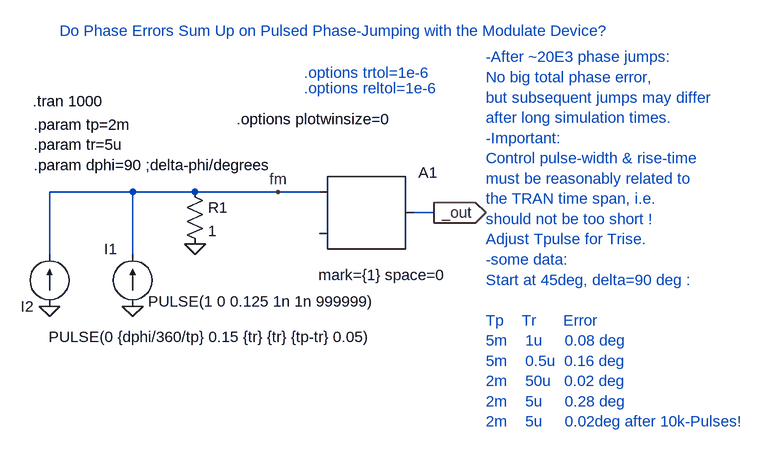
[diagram p0: schematic Ctrl_phase_Modulate_Phase_Error.asc]
Ctrl_phase_Modulate_Phase_Error.asc, the LTspice schematic file:
Version 4
SHEET 1 1348 932
WIRE -336 528 -464 528
WIRE -240 528 -336 528
WIRE -112 528 -240 528
WIRE -48 528 -112 528
WIRE 128 560 96 560
WIRE -464 624 -464 528
WIRE -336 624 -336 528
FLAG 128 560 _out
IOPIN 128 560 Out
FLAG -112 528 fm
FLAG -336 704 0
FLAG -240 608 0
FLAG -464 704 0
SYMBOL modulate -48 528 R0
WINDOW 3 -2 128 Left 0
WINDOW 123 16 -20 Left 0
SYMATTR Value mark={1} space=0
SYMATTR InstName A1
SYMBOL current -336 704 R180
WINDOW 0 24 88 Left 0
WINDOW 3 -375 7 Left 0
SYMATTR InstName I1
SYMATTR Value PULSE(1 0 0.125 1n 1n 999999)
SYMBOL res -256 512 R0
SYMATTR InstName R1
SYMATTR Value 1
SYMBOL current -464 704 R180
WINDOW 3 -501 -47 Left 0
WINDOW 123 0 0 Left 0
WINDOW 39 0 0 Left 0
SYMATTR Value PULSE(0 {dphi/360/tp} 0.15 {tr} {tr} {tp-tr} 0.05)
SYMATTR InstName I2
TEXT -490 388 Left 0 !.tran 1000
TEXT -176 416 Left 0 !.options plotwinsize=0
TEXT -488 424 Left 0 !.param tp=2m\n.param tr=5u\n.param dphi=90 ;delta-phi/degrees
TEXT -72 344 Left 0 ;.options trtol=1e-6
TEXT -72 368 Left 0 ;.options reltol=1e-6
TEXT -448 280 Left 0 ;Do Phase Errors Sum Up on Pulsed Phase-Jumping with the Modulate Device?
TEXT 208 320 Left 0 ;-After ~20E3 phase jumps:\nNo big total phase error,\nbut subsequent jumps may differ\nafter long simulation times.\n-Important:\nControl pulse-width & rise-time\nmust be reasonably related to\nthe TRAN time span, i.e.\nshould not be too short !\nAdjust Tpulse for Trise.\n-some data:\nStart at 45deg, delta=90 deg :\n \nTp    Tr      Error\n5m    1u     0.08 deg\n5m    0.5u  0.16 deg\n2m    50u   0.02 deg\n2m    5u     0.28 deg\n2m    5u     0.02deg after 10k-Pulses!

The netlist it stands for:
* Ctrl_phase_Modulate_Phase_Error.asc
A1 fm 0 0 0 0 0 _out 0 MODULATOR mark={1} space=0
I1 0 fm PULSE(1 0 0.125 1n 1n 999999)
R1 fm 0 1
I2 0 fm PULSE(0 {dphi/360/tp} 0.15 {tr} {tr} {tp-tr} 0.05)
.tran 1000
.options plotwinsize=0
.param tp=2m
.param tr=5u
.param dphi=90 ;delta-phi/degrees
* .options trtol=1e-6
* .options reltol=1e-6
* Do Phase Errors Sum Up on Pulsed Phase-Jumping with the Modulate Device?
* -After ~20E3 phase jumps:
* No big total phase error,
* but subsequent jumps may differ
* after long simulation times.
* -Important:
* Control pulse-width & rise-time
* must be reasonably related to
* the TRAN time span, i.e.
* should not be too short !
* Adjust Tpulse for Trise.
* -some data:
* Start at 45deg, delta=90 deg :
* Tp    Tr      Error
* 5m    1u     0.08 deg
* 5m    0.5u  0.16 deg
* 2m    50u   0.02 deg
* 2m    5u     0.28 deg
* 2m    5u     0.02deg after 10k-Pulses!
.backanno
.end